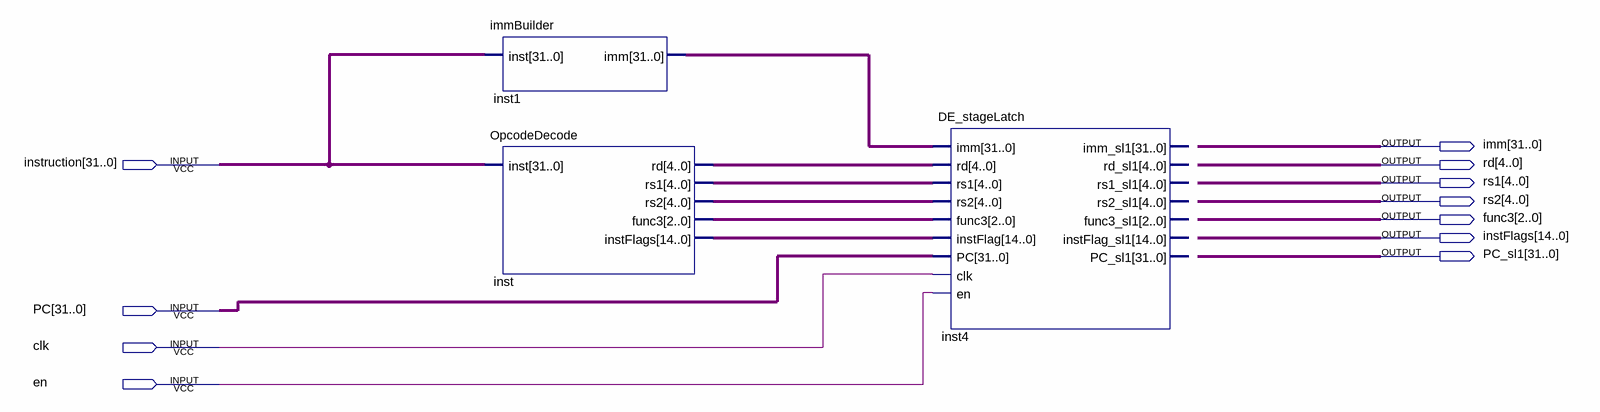
[diagram p0: schematic sheet]
// Quartus schematic decoder.bdf as structural Verilog: 3 symbols, 11 pins
module decoder (
  input  [31:0] instruction,
  input  [31:0] PC,
  input  clk,
  input  en,
  output [31:0] imm,
  output [4:0] rd,
  output [4:0] rs1,
  output [4:0] rs2,
  output [2:0] func3,
  output [14:0] instFlags,
  output [31:0] PC_sl1
);

  wire [2:0] inst_func3;
  wire [4:0] inst_rd, inst_rs1, inst_rs2;
  wire [14:0] inst_instflags;
  wire [31:0] inst1_imm;

  immBuilder inst1 (.inst(instruction), .imm(inst1_imm));
  OpcodeDecode inst (
    .inst(instruction), .rd(inst_rd), .rs1(inst_rs1), .rs2(inst_rs2), .func3(inst_func3),
    .instFlags(inst_instflags));
  DE_stageLatch inst4 (
    .imm(inst1_imm), .rd(inst_rd), .rs1(inst_rs1), .rs2(inst_rs2), .func3(inst_func3),
    .instFlag(inst_instflags), .PC(PC), .clk(clk), .en(en));  // open: imm_sl1, rd_sl1, rs1_sl1, rs2_sl1, func3_sl1, instFlag_sl1, PC_sl1
endmodule
